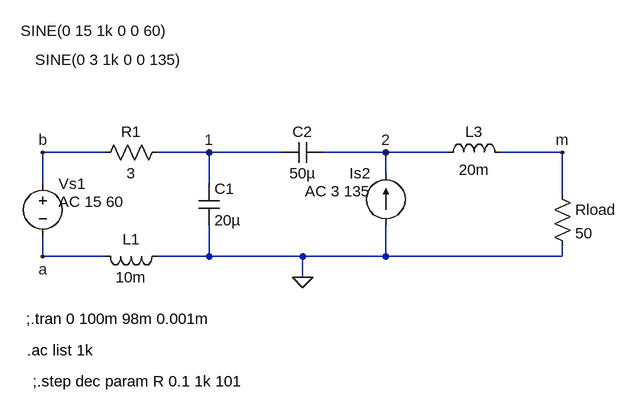
[diagram p0: schematic RTR806_Class_15_20231109_Investigation_of_methods.asc]
RTR806_Class_15_20231109_Investigation_of_methods.asc, the LTspice schematic file:
Version 4
SHEET 1 936 680
WIRE 144 64 48 64
WIRE 304 64 224 64
WIRE 416 64 304 64
WIRE 576 64 480 64
WIRE 672 64 576 64
WIRE 848 64 752 64
WIRE 576 96 576 64
WIRE 48 112 48 64
WIRE 304 112 304 64
WIRE 848 128 848 64
WIRE 48 224 48 192
WIRE 144 224 48 224
WIRE 304 224 304 176
WIRE 304 224 224 224
WIRE 448 224 304 224
WIRE 576 224 576 176
WIRE 576 224 448 224
WIRE 848 224 848 208
WIRE 848 224 576 224
WIRE 448 256 448 224
FLAG 448 256 0
FLAG 304 64 1
FLAG 576 64 2
FLAG 848 64 m
FLAG 48 224 a
FLAG 48 64 b
SYMBOL voltage 48 96 R0
WINDOW 3 -34 -219 Left 2
WINDOW 123 24 44 Left 2
WINDOW 39 0 0 Left 0
SYMATTR InstName Vs1
SYMATTR Value SINE(0 15 1k 0 0 60)
SYMATTR Value2 AC 15 60
SYMBOL res 240 48 R90
WINDOW 0 0 56 VBottom 2
WINDOW 3 32 56 VTop 2
SYMATTR InstName R1
SYMATTR Value 3
SYMBOL cap 288 112 R0
SYMATTR InstName C1
SYMATTR Value 20µ
SYMBOL ind 240 208 R90
WINDOW 0 5 56 VBottom 2
WINDOW 3 32 56 VTop 2
SYMATTR InstName L1
SYMATTR Value 10m
SYMATTR SpiceLine Rser=0
SYMBOL cap 480 48 R90
WINDOW 0 0 32 VBottom 2
WINDOW 3 32 32 VTop 2
SYMATTR InstName C2
SYMATTR Value 50µ
SYMBOL current 576 176 R180
WINDOW 0 24 80 Left 2
WINDOW 3 314 255 Left 2
WINDOW 123 24 52 Left 2
WINDOW 39 0 0 Left 0
SYMATTR InstName Is2
SYMATTR Value SINE(0 3 1k 0 0 135)
SYMATTR Value2 AC 3 135
SYMBOL ind 656 80 R270
WINDOW 0 32 56 VTop 2
WINDOW 3 5 56 VBottom 2
SYMATTR InstName L3
SYMATTR Value 20m
SYMATTR SpiceLine Rser=0
SYMBOL res 832 112 R0
SYMATTR InstName Rload
SYMATTR Value 50
TEXT 22 320 Left 2 !;.tran 0 100m 98m 0.001m
TEXT 24 368 Left 2 !.ac list 1k
TEXT 32 416 Left 2 !;.step dec param R 0.1 1k 101

The netlist it stands for:
* RTR806_Class_15_20231109_Investigation_of_methods.asc
Vs1 b a SINE(0 15 1k 0 0 60) AC 15 60
R1 1 b 3
C1 1 0 20µ
L1 0 a 10m Rser=0
C2 2 1 50µ
Is2 0 2 SINE(0 3 1k 0 0 135) AC 3 135
L3 2 m 20m Rser=0
Rload m 0 50
;.tran 0 100m 98m 0.001m
.ac list 1k
;.step dec param R 0.1 1k 101
.backanno
.end